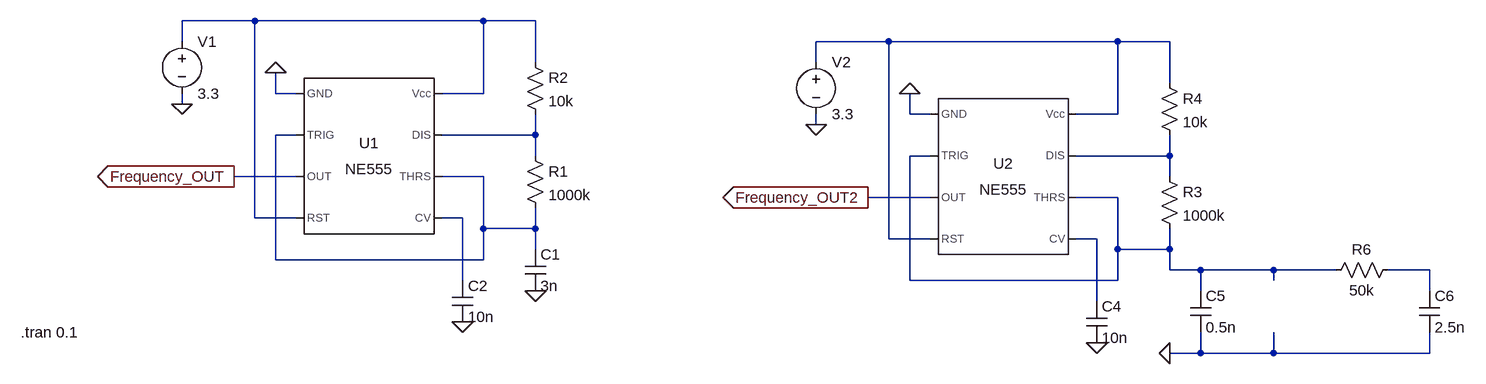
[diagram p0: schematic NE555.asc]
NE555.asc, the LTspice schematic file:
Version 4
SHEET 1 2344 1108
WIRE 0 576 -112 576
WIRE 352 576 0 576
WIRE 432 576 352 576
WIRE -112 608 -112 576
WIRE 976 608 864 608
WIRE 1328 608 976 608
WIRE 1408 608 1328 608
WIRE 432 640 432 576
WIRE 864 640 864 608
WIRE 1408 672 1408 608
WIRE 32 688 32 656
WIRE 64 688 32 688
WIRE 352 688 352 576
WIRE 352 688 288 688
WIRE -112 704 -112 688
WIRE 1008 720 1008 688
WIRE 1040 720 1008 720
WIRE 1328 720 1328 608
WIRE 1328 720 1264 720
WIRE 864 736 864 720
WIRE 64 752 32 752
WIRE 432 752 432 720
WIRE 432 752 288 752
WIRE 432 784 432 752
WIRE 1040 784 1008 784
WIRE 1408 784 1408 752
WIRE 1408 784 1264 784
WIRE 64 816 -32 816
WIRE 352 816 288 816
WIRE 1408 816 1408 784
WIRE 1040 848 944 848
WIRE 1328 848 1264 848
WIRE 0 880 0 576
WIRE 64 880 0 880
WIRE 320 880 288 880
WIRE 352 896 352 816
WIRE 432 896 432 864
WIRE 432 896 352 896
WIRE 976 912 976 608
WIRE 1040 912 976 912
WIRE 1296 912 1264 912
WIRE 432 928 432 896
WIRE 1328 928 1328 848
WIRE 1408 928 1408 896
WIRE 1408 928 1328 928
WIRE 32 944 32 752
WIRE 352 944 352 896
WIRE 352 944 32 944
WIRE 1408 960 1408 928
WIRE 1456 960 1408 960
WIRE 1568 960 1456 960
WIRE 1664 960 1568 960
WIRE 1808 960 1744 960
WIRE 320 976 320 880
WIRE 1008 976 1008 784
WIRE 1328 976 1328 928
WIRE 1328 976 1008 976
WIRE 1568 976 1568 960
WIRE 1456 992 1456 960
WIRE 1808 992 1808 960
WIRE 1296 1008 1296 912
WIRE 1456 1088 1456 1056
WIRE 1456 1088 1408 1088
WIRE 1568 1088 1568 1056
WIRE 1568 1088 1456 1088
WIRE 1808 1088 1808 1056
WIRE 1808 1088 1568 1088
FLAG 432 992 0
FLAG 32 656 0
FLAG -112 704 0
FLAG 320 1040 0
FLAG -32 816 Frequency_OUT
IOPIN -32 816 Out
FLAG 1008 688 0
FLAG 864 736 0
FLAG 1296 1072 0
FLAG 944 848 Frequency_OUT2
IOPIN 944 848 Out
FLAG 1408 1088 0
SYMBOL Misc\\NE555 176 784 R0
SYMATTR InstName U1
SYMBOL res 416 768 R0
SYMATTR InstName R1
SYMATTR Value 1000k
SYMBOL res 416 624 R0
SYMATTR InstName R2
SYMATTR Value 10k
SYMBOL cap 416 928 R0
SYMATTR InstName C1
SYMATTR Value 3n
SYMBOL voltage -112 592 R0
WINDOW 123 0 0 Left 0
WINDOW 39 0 0 Left 0
SYMATTR InstName V1
SYMATTR Value 3.3
SYMBOL cap 304 976 R0
SYMATTR InstName C2
SYMATTR Value 10n
SYMBOL Misc\\NE555 1152 816 R0
SYMATTR InstName U2
SYMBOL res 1392 800 R0
SYMATTR InstName R3
SYMATTR Value 1000k
SYMBOL res 1392 656 R0
SYMATTR InstName R4
SYMATTR Value 10k
SYMBOL voltage 864 624 R0
WINDOW 123 0 0 Left 0
WINDOW 39 0 0 Left 0
SYMATTR InstName V2
SYMATTR Value 3.3
SYMBOL cap 1280 1008 R0
SYMATTR InstName C4
SYMATTR Value 10n
SYMBOL cap 1440 992 R0
SYMATTR InstName C5
SYMATTR Value 0.5n
SYMBOL res 1760 944 R90
WINDOW 0 0 56 VBottom 2
WINDOW 3 32 56 VTop 2
SYMATTR InstName R6
SYMATTR Value 50k
SYMBOL cap 1792 992 R0
SYMATTR InstName C6
SYMATTR Value 2.5n
TEXT -360 1056 Left 2 !.tran 0.1

The netlist it stands for:
* NE555.asc
XU1 0 N003 Frequency_OUT N001 N007 N003 N004 N001 NE555  ; pins GND TRIG OUT RST CV THRS DIS Vcc
R1 N004 N003 1000k
R2 N001 N004 10k
C1 N003 0 3n
V1 N001 0 3.3
C2 N007 0 10n
XU2 0 N005 Frequency_OUT2 N002 N008 N005 N006 N002 NE555  ; pins GND TRIG OUT RST CV THRS DIS Vcc
R3 N006 N005 1000k
R4 N002 N006 10k
V2 N002 0 3.3
C4 N008 0 10n
C5 N005 0 0.5n
R6 N009 N005 50k
C6 N009 0 2.5n
.tran 0.1
.lib NE555.sub
.backanno
.end